# EAGLE schematic standroid (EAGLE 9.2.2)
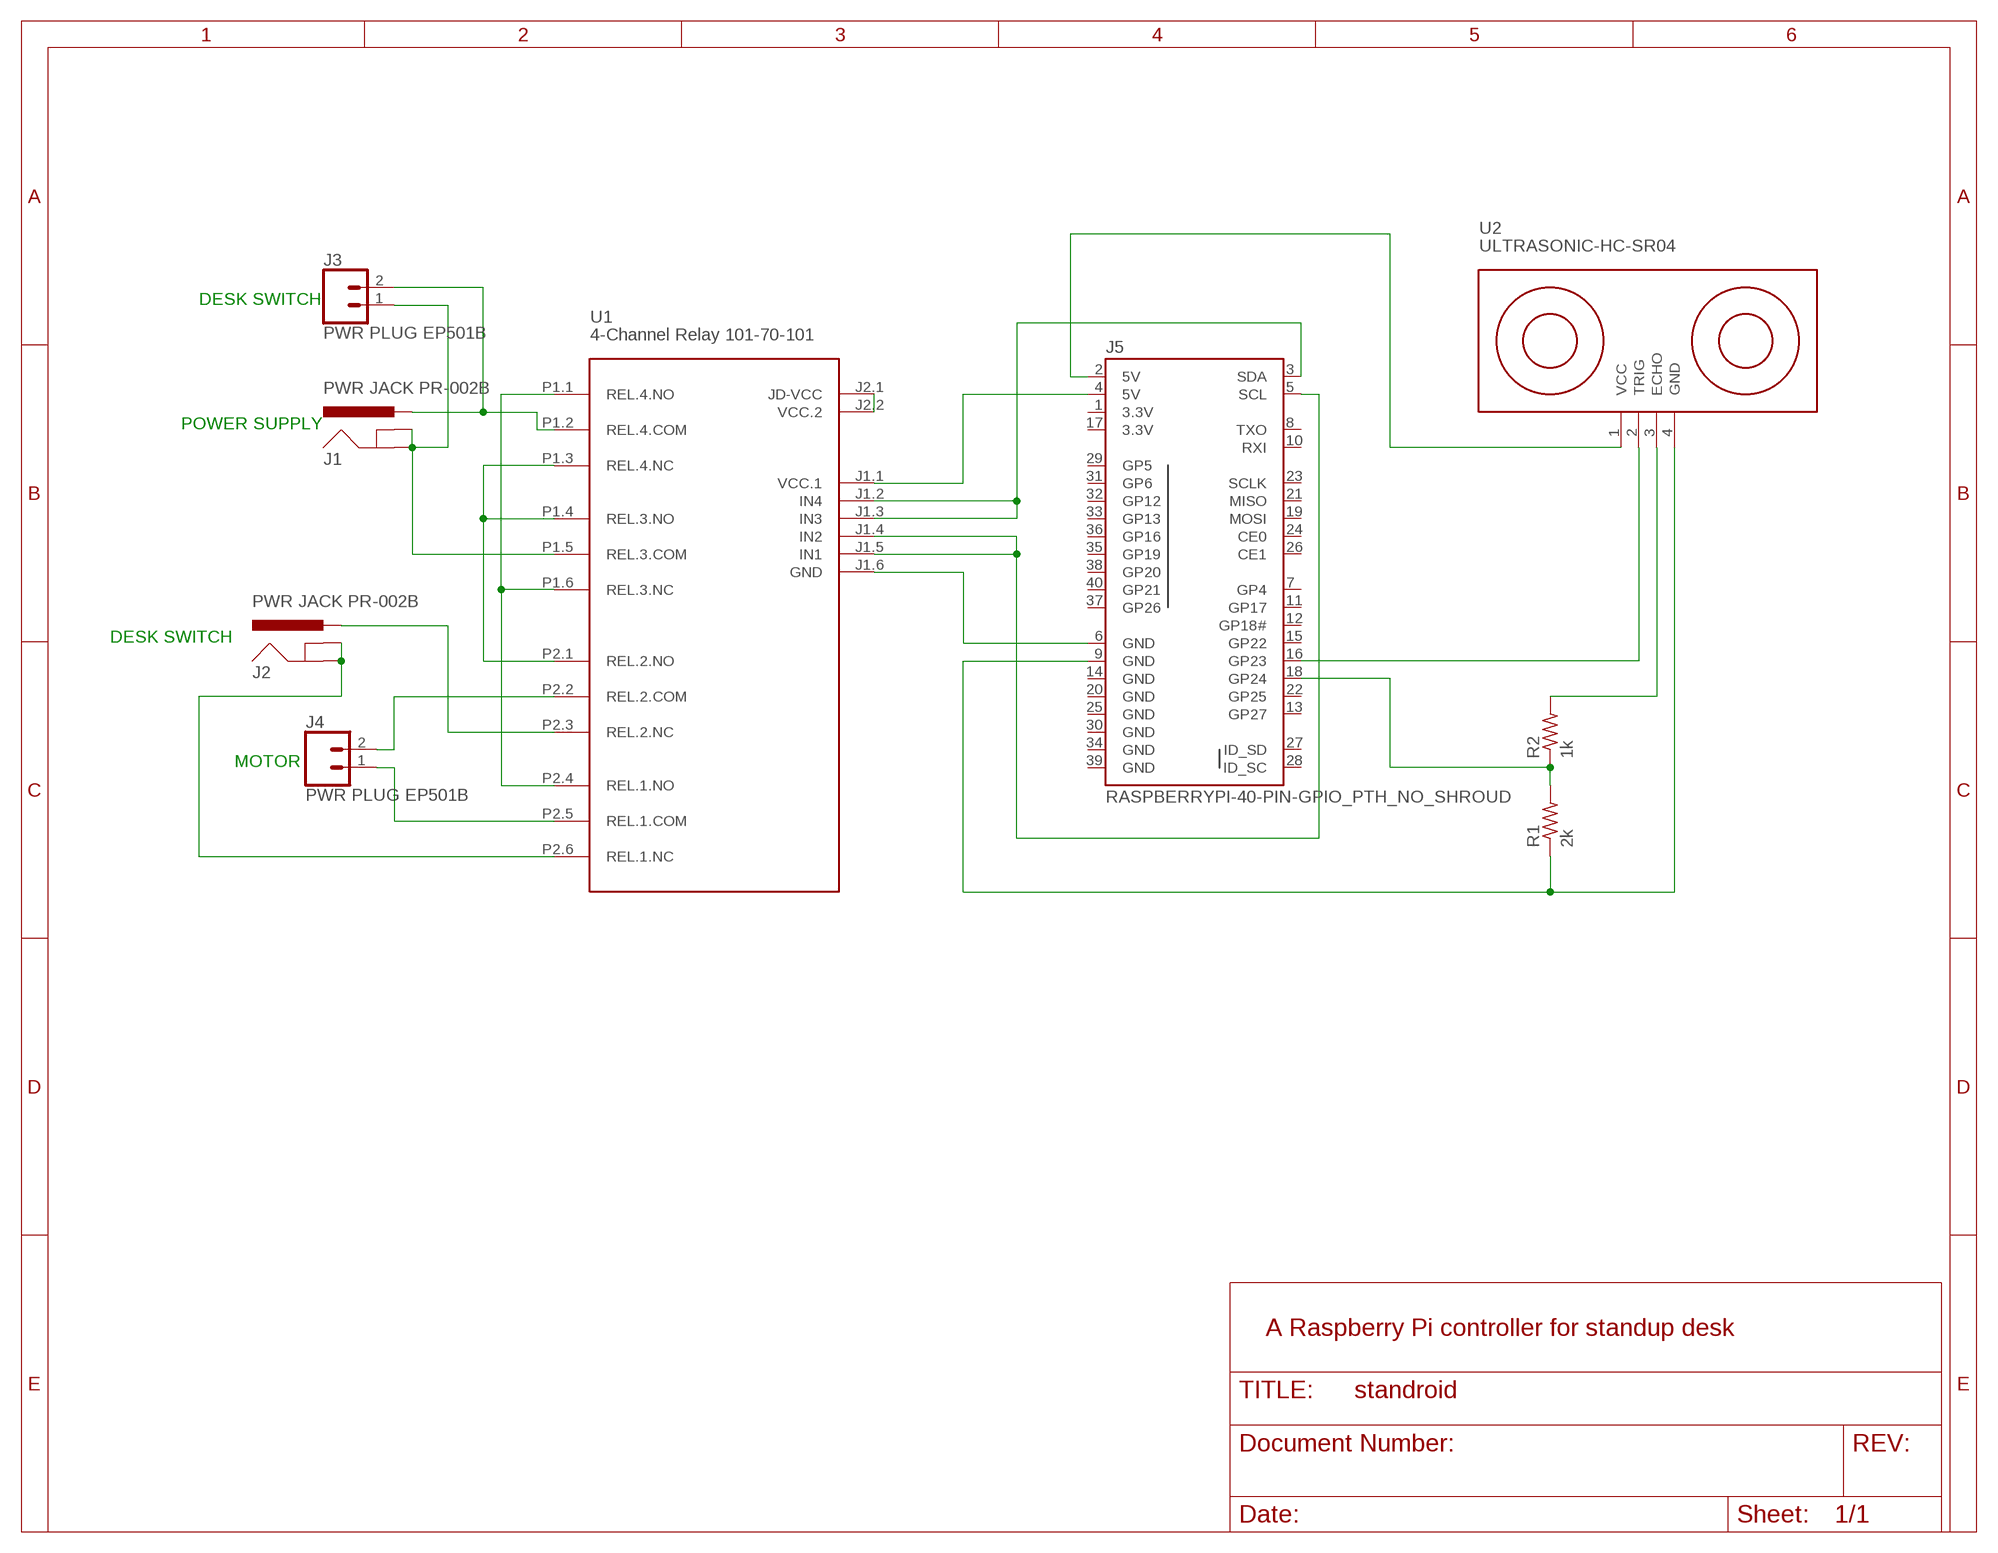
[diagram p0: schematic, sheet 1]
FRAME1 (FRAME_A_L): DESCRIPTION: A Raspberry Pi controller for standup desk

## Parts
J1  PWR JACK PR-002B  POWER_JACK  [POWER_JACK_PTH]
J2  PWR JACK PR-002B  POWER_JACK  [POWER_JACK_PTH]
J3  PWR PLUG EP501B  CONN_021X02_NO_SILK  [1X02_NO_SILK]
J4  PWR PLUG EP501B  CONN_021X02_NO_SILK  [1X02_NO_SILK]
J5  RASPBERRYPI-40-PIN-GPIO_PTH_NO_SHROUD  [2X20]
R1  2k  R-US_0617/17  [0617/17]
R2  1k  R-US_0617/17  [0617/17]
U1  4-Channel Relay 101-70-101  RELAY-4-SRD#RC  [RELAY-4-SRD#RC]
U2  ULTRASONIC-HC-SR04  [ULTRASONIC-HC-SR04]

## Nets
N$1: J1.PWR J3.2 U1.P1.2(REL.4.COM)
N$2: J2.GND J2.GNDBREAK U1.P2.6(REL.1.NC)
N$3: J1.GND J1.GNDBREAK J3.1 U1.P1.5(REL.3.COM)
N$4: J4.1 U1.P2.5(REL.1.COM)
N$5: J4.2 U1.P2.2(REL.2.COM)
N$6: J2.PWR U1.P2.3(REL.2.NC)
N$7: U1.P1.3(REL.4.NC) U1.P1.4(REL.3.NO) U1.P2.1(REL.2.NO)
N$8: U1.P1.1(REL.4.NO) U1.P1.6(REL.3.NC) U1.P2.4(REL.1.NO)
N$9: U1.J2.1(JD-VCC) U1.J2.2(VCC.2)
N$10: J5.4(5V) U1.J1.1(VCC.1)
N$11: J5.9(GND) R1.1 U2.4(GND)
N$12: J5.3(SDA) U1.J1.2(IN4) U1.J1.3(IN3)
N$13: J5.5(SCL) U1.J1.4(IN2) U1.J1.5(IN1)
N$14: J5.2(5V) U2.1(VCC)
N$15: J5.16(GP23) U2.2(TRIG)
N$16: J5.18(GP24) R1.2 R2.1
N$17: R2.2 U2.3(ECHO)
N$18: J5.6(GND) U1.J1.6(GND)
Unconnected: J5.7(GP4) J5.8(TXO) J5.10(RXI) J5.11(GP17) J5.12(GP18#) J5.13(GP27) J5.15(GP22) J5.19(MOSI) J5.21(MISO) J5.22(GP25) J5.23(SCLK) J5.24(CE0) J5.26(CE1) J5.27(ID_SD) J5.28(ID_SC) J5.29(GP5) J5.31(GP6) J5.32(GP12) J5.33(GP13) J5.35(GP19) J5.36(GP16) J5.37(GP26) J5.38(GP20) J5.40(GP21)

## Notes on the sheet
- DESK SWITCH
- POWER SUPPLY
- DESK SWITCH
- MOTOR

## Power pins joined to a net without a drawn wire
3.3V: J5.1(3.3V) J5.17(3.3V)
GND: J5.14(GND) J5.20(GND) J5.25(GND) J5.30(GND) J5.34(GND) J5.39(GND)

## Library data of the parts
J1 J2 = SparkFun-Connectors:POWER_JACK: Power Jack Connector This is the standard 5.5mm barrel jack for power. The PTH is the most common, proven, reliable, footprint. The Slot footprint only works if the mill layer is transmitted to the PCB fab house so be warned. Here are the connectors we sell at SparkFun: DC Barrel Power Jack/Connector <https://www.sparkfun.com/products/119> (PRT-00119) DC Barrel Power Jack/Connector (SMD) <https://www.sparkfun.com/products/12748> (PRT-12748) DC Barrel Jack Adapter - Breadboard Compatible <https://www.sparkfun.com/products/10811> (PRT-10811) It is used on this SparkFun product (and many, many others): SparkFun RedBoard - Programmed with Arduino <https://www.sparkfun.com/products/12757> (DEV-12757) Also, if you need a mating power supply or connector, please check these out: Wall Adapter Power Supply - 9VDC 650mA <https://www.sparkfun.com/products/298> (TOL-00298) DC Barrel Jack Adapter - Male <https://www.sparkfun.com/products/10287> (PRT-10287); PROD_ID: CONN-08197
J3 J4 = SparkFun-Connectors:CONN_02: Multi connection point. Often used as Generic Header-pin footprint for 0.1 inch spaced/style header connections On any of the 0.1 inch spaced packages, you can populate with these: Break Away Headers - Straight <https://www.sparkfun.com/products/116> (PRT-00116) Break Away Male Headers - Right Angle <https://www.sparkfun.com/products/553> (PRT-00553) Female Headers <https://www.sparkfun.com/products/115> (PRT-00115) Break Away Headers - Machine Pin <https://www.sparkfun.com/products/117> (PRT-00117) Break Away Female Headers - Swiss Machine Pin <https://www.sparkfun.com/products/743> (PRT-00743) For SCREWTERMINALS and SPRING TERMINALS visit here: Screw Terimnals on SparkFun.com <https://www.sparkfun.com/search/results?term=Screw+Terminals> (5mm/3.5mm/2.54mm spacing) This device is also useful as a general connection point to wire up your design to another part of your project. Our various solder wires solder well into these plated through hole pads. Hook-Up Wire - Assortment (Stranded, 22 AWG) <https://www.sparkfun.com/products/11375> (PRT-11375) Hook-Up Wire - Assortment (Solid Core, 22 AWG) <https://www.sparkfun.com/products/11367> (PRT-11367) View the entire wire category on our website here <https://www.sparkfun.com/categories/141> Special notes: Molex polarized connector foot print use with: PRT-08233 with associated crimp pins and housings. 2.54_SCREWTERM for use with PRT-10571. 3.5mm Screw Terminal footprints for PRT-08084 5mm Screw Terminal footprints for use with PRT-08432
J5 = SparkFun-Connectors:RASPBERRYPI-40-PIN-GPIO: Raspberry Pi GPIO Header 2x20 pin connector, as found on B, B+, A+ models. Both shrouded PTH and SMT versions available. SparkFun Products: GPIO Shrouded Header <https://www.sparkfun.com/products/13054>- PTH SparkFun Pi Wedge (Preassembled) <https://www.sparkfun.com/products/13717>
R1 R2 = resistor:R-US_: RESISTOR, American symbol
U1 = diy-modules:RELAY-4-SRD#RC: 4-Channel Relay Module based on SRD-05VDC-SL-C relays Symbol with relays pins Click here to find device on ebay.com <http://www.ebay.com/sch/four+channel+relay+module+optocoupler+5v>
U2 = diy-modules:ULTRASONIC-HC-SR04: Ultrasonic Ranging Module HC-SR04 More details available here: http://randomnerdtutorials.com/complete-guide-for-ultrasonic-sensor-hc-sr04/ Click here to find device on ebay.com <http://www.ebay.com/sch/hc+sr04+ultrasonic>